# EasyEDA schematic gas-sensor_2021-07-04.json
TITLE: Gas-Sensor; REV: 1.0; Date: 2021-06-20; Sheet: 1/1; Drawn By: msrameshp; Company: Ramesh Perera
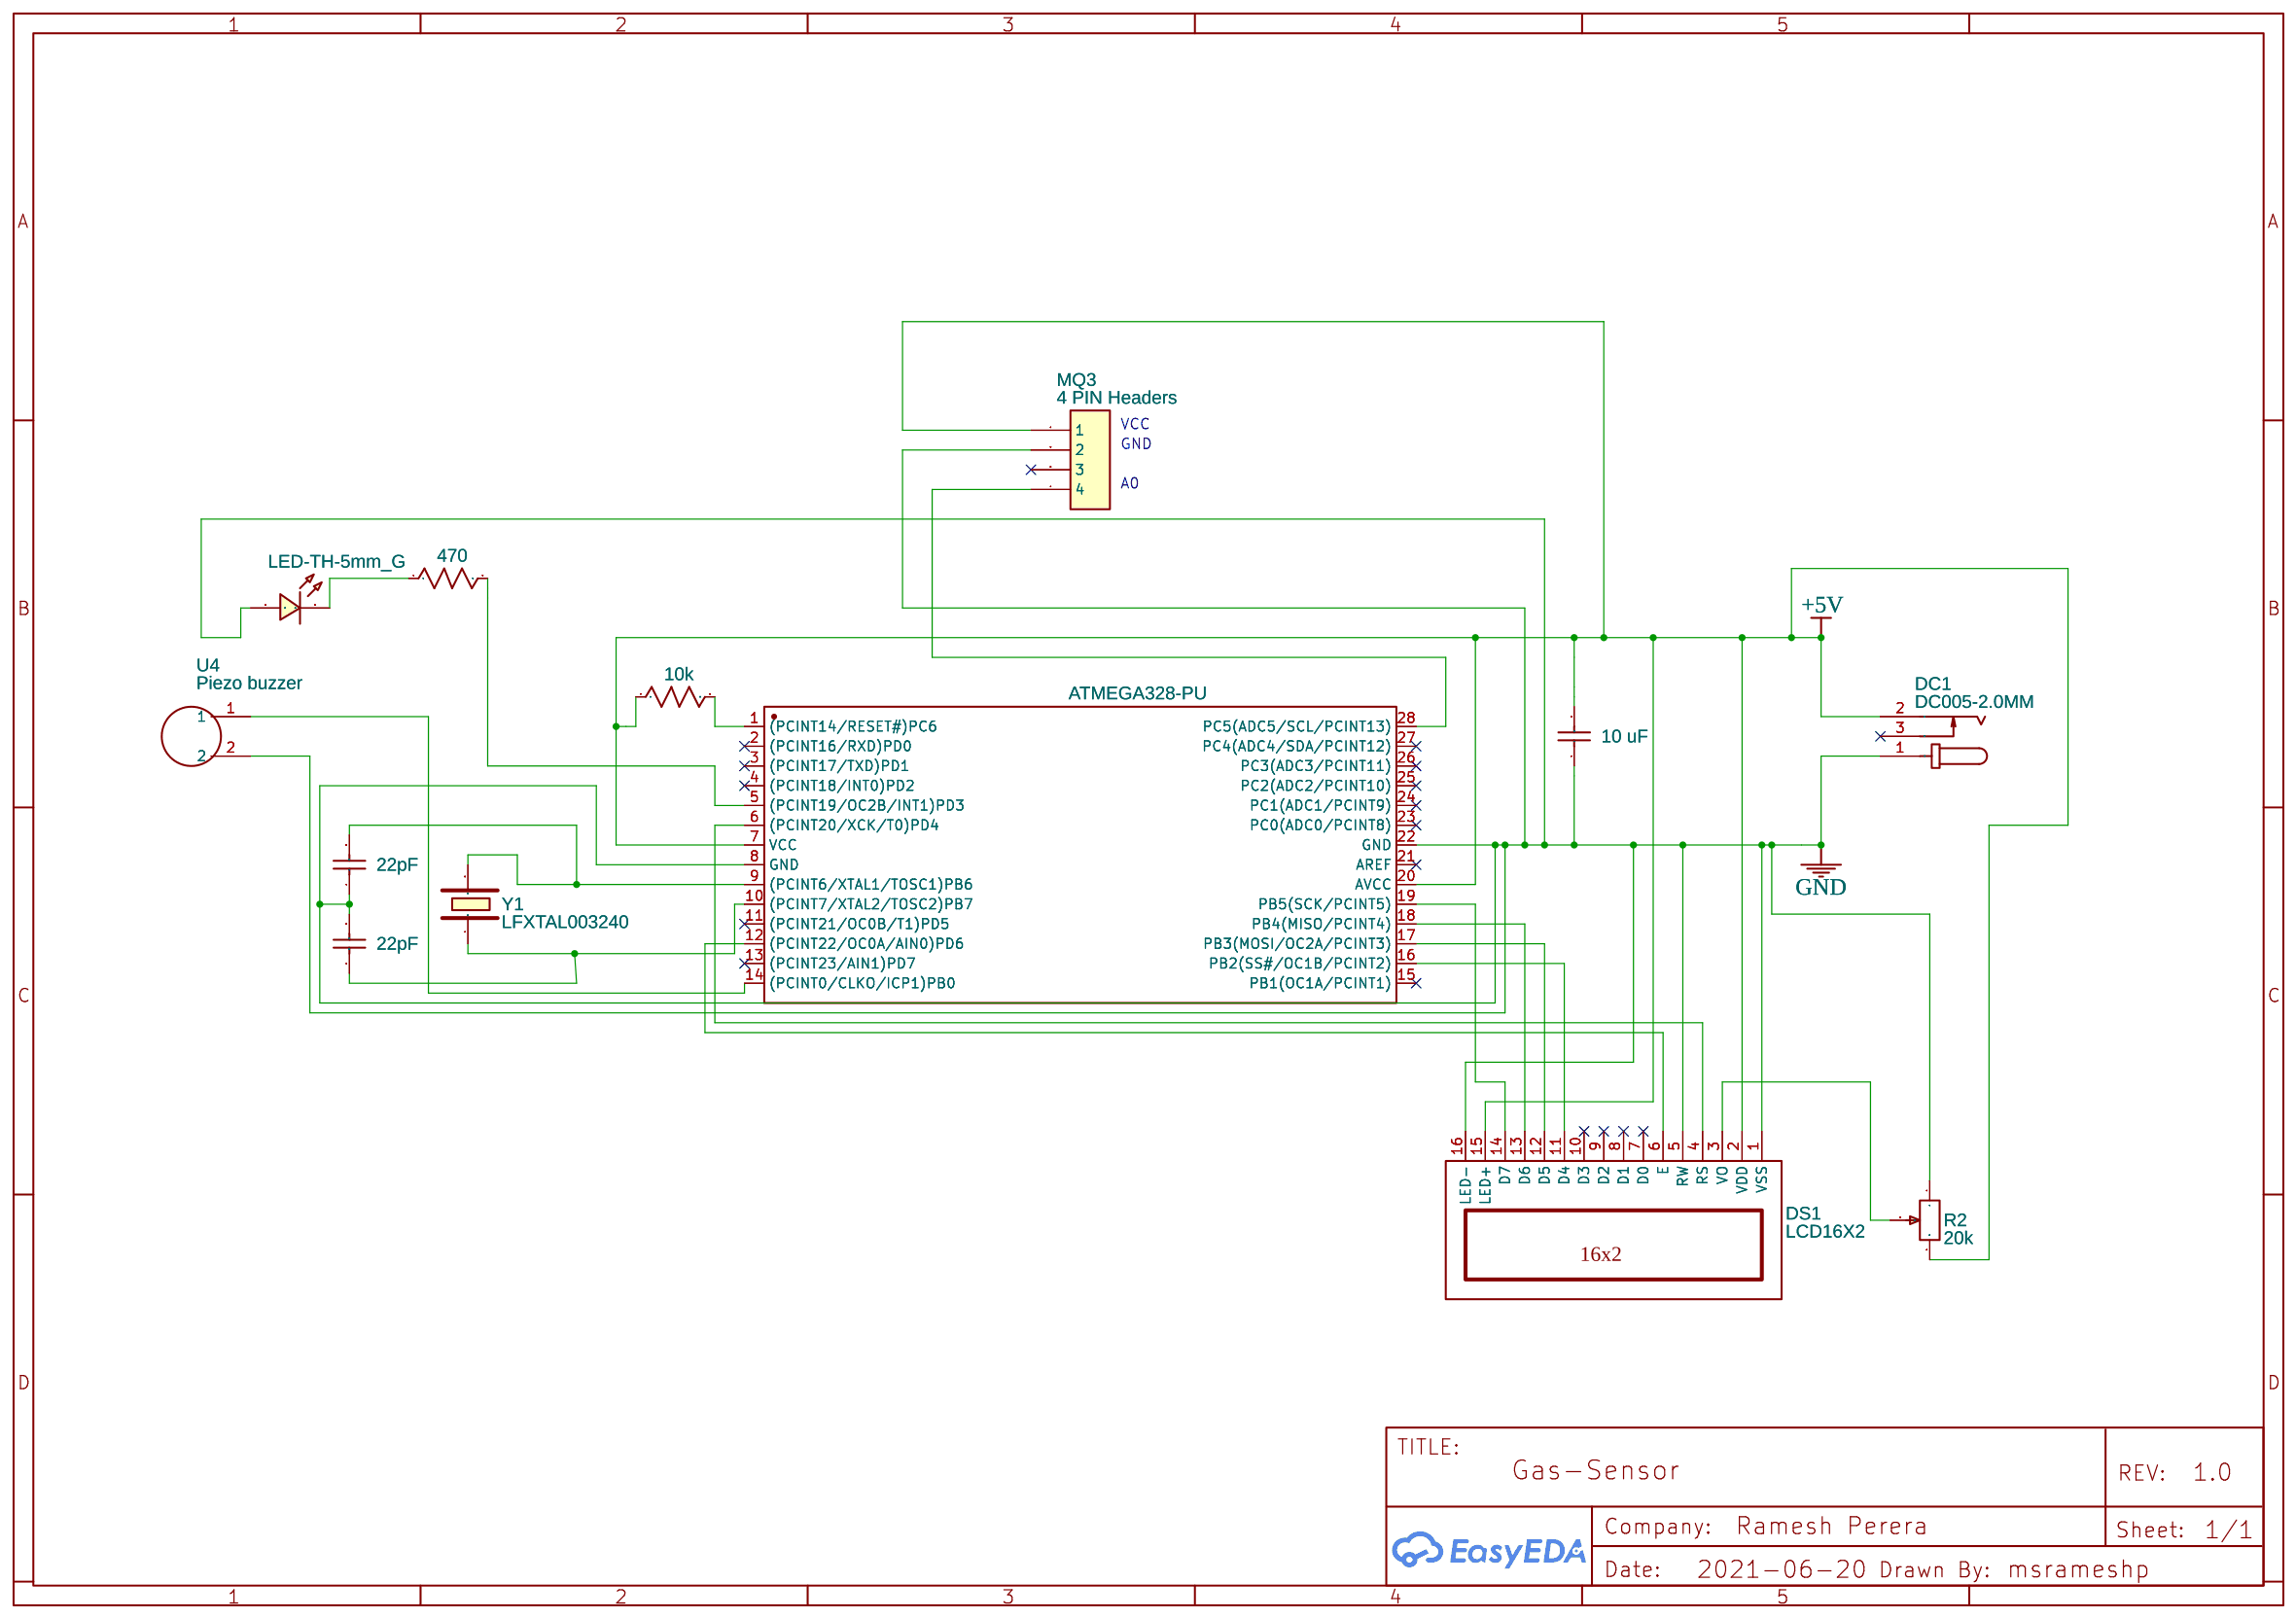
[diagram p0: schematic sheet]

## Parts
C1  22pF  [CAP-TH_L5.0-W4.0-P5.00-D1.0]
C2  10 uF  [CAP-TH_L5.0-W4.0-P5.00-D1.0]
C4  22pF  [CAP-TH_L5.0-W4.0-P5.00-D1.0]
DC1  DC005-2.0MM  [DC-IN-TH_DC005]
DS1  LCD16X2  [WC1602A]
LED1  LED-TH-5mm_G  [LED-TH_BD5.0_GREEN]
MQ3  4 PIN Headers  [4_PIN_HEADER_MDG]
R2  20k  [RES-ADJ_3296W]
R3  10k  [R_AXIAL-0.3]
R4  470  [R_AXIAL-0.3]
U1  ATMEGA328-PU  [DIP-28_L35.0-W6.5-P2.54-LS7.6-BL]
U4  Piezo buzzer  [TP124005-2]
Y1  LFXTAL003240  [PKG-HC49U-V]

## Library data of the parts
C1 C2 C4 = Ceramic capacitors47PF 3KV: Supplier: LCSC; Manufacturer: ReliaPro; Supplier Part: C19375
DC1 = DC005-2.0MM: Supplier: LCSC; Manufacturer: SOFNG; Supplier Part: C111567
DS1 = LCD16X2: Contributor: KiCad; sourceId: o6GEdzxTR
LED1 = LED-TH-5mm_G: Manufacturer: EVERLIGHT(台湾亿光); Manufacturer Part: 333-2SYGD/S530-E2; Supplier Part: C88163; Supplier: LCSC; Contributor: LCEDA_Lib
MQ3 = 4 PIN Headers: Manufacturer Part: New SchematicLib; Contributor: Gavin Ferry; Supplier: DealsExtreme
R2 = 3296W-1-104LF: Supplier: LCSC; Manufacturer: Bochen; Contributor: LCSC; Supplier Part: C118963
R3 R4 = R_AXIAL-0.3_US: Contributor: LCEDA_Lib
U1 = ATMEGA328-PU: Supplier: LCSC; Supplier Part: C613508; Manufacturer: MICROCHIP(美国微芯); Contributor: LCSC; JLCPCB Part Class: Extended Part
U4 = Piezo buzzer: Manufacturer: DB Unlimited; Supplier: Digi-Key; Supplier Part: 2104-TP124005-2CT-ND; Contributor: Ginodel
Y1 = LFXTAL003240: frequency: 16MHz; Supplier Part: 9713700; Supplier: Element14; Manufacturer: IQD FREQUENCY PRODUCTS; link: http://www.farnell.com/datasheets/2306754.pdf?_ga=2.144952627.664711881.1510158588-238689616.1505921947&_gac=1.245623472.1510158588.EAIaIQobChMIqoD3jrOv1wIVgwrTCh2CCwl7EAAYASAAEgKQo_D_BwE; Contributor: Prof. Ing. F. Scordino

## Nets
+5V: C2.2 DC1.2 DS1.2(VDD) DS1.15(LED+) MQ3.1 R2.3 R3.1 U1.7(VCC) U1.20(AVCC)
GND: C1.2 C2.1 C4.1 DC1.1 DS1.1(VSS) DS1.5(RW) DS1.16(LED-) LED1.1 MQ3.2 R2.1 U1.8(GND) U1.22(GND) U4.2
Net-(C1-1): C1.1 U1.10((PCINT7/XTAL2/TOSC2)PB7) Y1.1
Net-(C4-2): C4.2 U1.9((PCINT6/XTAL1/TOSC1)PB6) Y1.2
Net-(DS1-3): DS1.3(VO) R2.2
Net-(DS1-4): DS1.4(RS) U1.6((PCINT20/XCK/T0)PD4)
Net-(DS1-6): DS1.6(E) U1.12((PCINT22/OC0A/AIN0)PD6)
Net-(DS1-11): DS1.11(D4) U1.16(PB2(SS#/OC1B/PCINT2))
Net-(DS1-12): DS1.12(D5) U1.17(PB3(MOSI/OC2A/PCINT3))
Net-(DS1-13): DS1.13(D6) U1.18(PB4(MISO/PCINT4))
Net-(DS1-14): DS1.14(D7) U1.19(PB5(SCK/PCINT5))
Net-(LED1-2): LED1.2 R4.1
Net-(MQ3-4): MQ3.4 U1.28(PC5(ADC5/SCL/PCINT13))
Net-(R3-2): R3.2 U1.1((PCINT14/RESET#)PC6)
Net-(R4-2): R4.2 U1.5((PCINT19/OC2B/INT1)PD3)
Net-(U1-14): U1.14((PCINT0/CLKO/ICP1)PB0) U4.1

Not connected (* = marked no-connect by the designer): DC1 3*; DS1 7(D0)* 8(D1)* 9(D2)* 10(D3)*; MQ3 3*; U1 2((PCINT16/RXD)PD0)* 3((PCINT17/TXD)PD1)* 4((PCINT18/INT0)PD2)* 11((PCINT21/OC0B/T1)PD5)* 13((PCINT23/AIN1)PD7)* 15(PB1(OC1A/PCINT1))* 21(AREF)* 23(PC0(ADC0/PCINT8))* 24(PC1(ADC1/PCINT9))* 25(PC2(ADC2/PCINT10))* 26(PC3(ADC3/PCINT11))* 27(PC4(ADC4/SDA/PCINT12))*

## Notes on the sheet
- VCC
- GND
- A0
